# Altium schematic sheet DBG.SchDoc
size A2; SheetNumber: 4; SheetTotal: 8
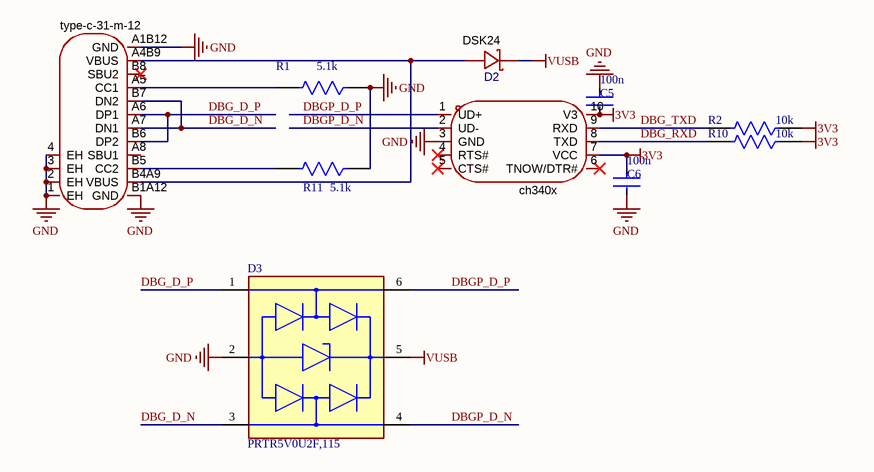
[diagram p0: DBG.SchDoc]

## Parts
C5  100n  [CAP_0402]
C6  100n  [CAP_0402]
D2  DSK24  [DSK24]
D3  PRTR5V0U2F,115  [FP-SOT886-MFG]
R1  5.1k  [RES_0402]
R2  10k  [RES_0402]
R10  10k  [RES_0402]
R11  5.1k  [RES_0402]
U2  ch340x  [ch340x]
USBC2  type-c-31-m-12  [TYPE-C-31-M-12]

## Nets
3V3: C5.2 C6.1 R2.1 R10.1 U2.7(VCC) U2.10(V3)
GND: C5.1 C6.2 D3.2(GND) R1.1 R11.1 U2.3(GND) USBC2.1(EH) USBC2.2(EH) USBC2.3(EH) USBC2.4(EH) USBC2.A1B12(GND) USBC2.B1A12(GND)
VUSB: D2.1(K) D3.5(VCC)
DBG_D_N: D3.3(I/O2) USBC2.A7(DN1) USBC2.B7(DN2)
DBG_D_P: D3.1(I/O1) USBC2.A6(DP1) USBC2.B6(DP2)
DBG_RXD: R10.2 U2.8(TXD)
DBG_TXD: R2.2 U2.9(RXD)
DBGP_D_N: D3.4(I/O2) U2.2(UD-)
DBGP_D_P: D3.6(I/O1) U2.1(UD+)
NetD2_2: D2.2(A) USBC2.A4B9(VBUS) USBC2.B4A9(VBUS)
NetR1_2: R1.2 USBC2.A5(CC1)
NetR11_2: R11.2 USBC2.B5(CC2)

Not connected (* = marked no-connect by the designer): U2 4(RTS#)* 5(CTS#)* 6(TNOW/DTR#)*; USBC2 A8(SBU1) B8(SBU2)*

## Library data of the parts
C5 C6 = CMP-03422-001116-1: C307331; Tolerance: 10%; Voltage Rating: 50V; Capacitance: 100nF; Value: 100nF; Max Operating Temperature: 125°C; Case Code (Metric): 1005; RoHS Compliant: Yes; Series: -; Case Code (Imperial): 0402; Min Operating Temperature: -55°C; Mount: Surface Mount; Case/Package: 0402; Packaging: Cut Tape
D2 = dsk24_c64890: C22466352; Manufacturer: MDD(辰达半导体); Symbol: DSK24 K24; AddInBom: yes; ModelId: 560a7cf99d0e44cb9af362aaf5d7923d; ModelName: SOD-123_L2.8-W1.8-LS3.7-RD; ModelTransform: 144.8816,62.992,0,0,0,0,0,0,0; Diode Configuration: Independent; Voltage - Forward(Vf@If): 550mV@2A; Voltage - DC Reverse(Vr): 40V; Current - Rectified: 2A; Reverse Leakage Current (Ir): 500uA@40V; Operating Junction Temperature Range: -55℃~+150℃; LCSC Part Name: 电压:40V 电流:2A; SupplierPart: C64890; ManufacturerPart: DSK24; Supplier Footprint: SOD-123FL; JLCPCB Part Class: Extended Part; Datasheet: https://item.szlcsc.com/datasheet/DSK24/65960.html; Supplier: LCSC; ConvertToPcb: yes; FootprintName: SOD-123_L2.8-W1.8-LS3.7-RD
D3 = CMP-14436-000003-1: C478118; Manufacturer: Nexperia; Capacitance: 1pF; Reverse Standoff Voltage: 5.5V; Number Of Channels: 2; Automotive Grade: Grade 3; Direction: Unidirectional; Value: 1pF; Breakdown Voltage: 6V; Octopart: https://octopart.com/prtr5v0u2f%2C115-nexperia-78741690; Height: 0.5mm; Category: Diode; RoHS: TRUE; Automotive: Yes; Digikey Description: TVS DIODE 5.5V 6XSON SOT886; Device Class L1: Circuit Protection; Ambient Temperature Range High: +85°C; ComponentLink2Description: Datasheet; Manufacturer Part Number: PRTR5V0U2F,115; Device Class L3: unset; Footprint Url: https://assets.nexperia.com/documents/outline-drawing/SOT886.pdf; Lead Free: Yes; Ambient Temperature Range Low: -40°C; Device Class L2: TVS Diodes; Package: SOT886; ComponentLink2URL: https://assets.nexperia.com/documents/data-sheet/PRTR5V0U2F_PRTR5V0U2K.pdf
R1 R11 = CMP-03412-016018-1: C25905; Tolerance: 1%; Temperature Coefficient: 100ppm/°C; Resistance: 5.1kOhm; Max Power Dissipation: 63mW; Value: 5.1kOhm; Ratings: AEC-Q200; Resistor Type: Thick Film; Number of Terminations: 2; RoHS Compliant: Yes; Min Operating Temperature: -55°C; Case/Package: 0402; Series: AC; Length: 0.039inch; Width: 0.02inch; Features: Moisture Resistant; Height: 0.015inch; Packaging: Tape and Reel; Max Operating Temperature: 155°C
R2 R10 = CMP-03412-016018-1: C25744; Tolerance: 1%; Temperature Coefficient: 100ppm/°C; Resistance: 10kOhm; Max Power Dissipation: 63mW; Value: 10kOhm; Ratings: AEC-Q200; Resistor Type: Thick Film; Number of Terminations: 2; RoHS Compliant: Yes; Min Operating Temperature: -55°C; Case/Package: 0402; Series: AC; Length: 0.039inch; Width: 0.02inch; Features: Moisture Resistant; Height: 0.015inch; Packaging: Tape and Reel; Max Operating Temperature: 155°C
U2 = ch340x: C3035748; Manufacturer: WCH(南京沁恒); AddInBom: yes; ModelId: 875cf331c88d40d1aea94374997f39b1; ModelName: MSOP-10_L3.0-W3.0-H1.1-LS5.0-P0.50; ModelTransform: 118.11,196.85,0,0,0,0,0,0,0; Applications Function: USB to serial；USB to Parallel; USB Protocol: USB 2.0; Voltage - Supply: 3.3V；5V; Data Rate: 2Mbps; Symbol: CH340X; Supplier: LCSC; Supplier Part: C3035748; Manufacturer Part: CH340X; JLCPCB Part Class: Extended Part; LCSC Part Name: CH340X; Supplier Footprint: MSOP-10; Datasheet: https://item.szlcsc.com/datasheet/CH340X/3584030.html; ConvertToPcb: yes; FootprintName: MSOP-10_L3.0-W3.0-P0.50-LS5.0-BL; Number of Channels: -; Operating Temperature: -20℃~+70℃; Current - Supply: -; Quiescent Supply Current: -
USBC2 = type-c-31-m-12: C165948; Manufacturer: 韩国韩荣; AddInBom: yes; ModelId: 8421221a464047838322348b3a9debc3; ModelName: USB-C_SMD-TYPE-C-31-M-12_1; ModelTransform: 351.9678,311.023,0,180,0,0,0,-43.307,-33.465; Connector Type: Type-C; Gender: Female; Number of Contacts: 16P; Number of Ports: 1; Current Rating-Power: 5A; Voltage Rating: 20V; Connect-Disconnect Life: 10,000 cycles; Symbol: TYPE-C-31-M-12; LCSC Part Name: Type-C 母 卧贴; SupplierPart: C165948; ManufacturerPart: TYPE-C-31-M-12; Supplier Footprint: SMD; JLCPCB Part Class: Extended Part; Datasheet: https://item.szlcsc.com/datasheet/TYPE-C-31-M-12/177331.html; Supplier: LCSC; ConvertToPcb: yes; FootprintName: USB-C_SMD-TYPE-C-31-M-12_1; Protocol Standard: -; Mounting Type: Surface Mount, Right Angle; Length: 7.35mm; Operating Temperature: -30℃~+80℃